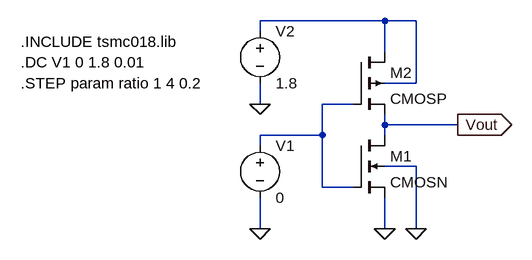
[diagram p0: schematic Assignment 5.asc]
Assignment 5.asc, the LTspice schematic file:
Version 4
SHEET 1 880 680
WIRE 496 160 304 160
WIRE 544 160 496 160
WIRE 304 176 304 160
WIRE 496 208 496 160
WIRE 544 256 544 160
WIRE 544 256 496 256
WIRE 304 288 304 256
WIRE 448 288 400 288
WIRE 496 320 496 304
WIRE 608 320 496 320
WIRE 400 336 400 288
WIRE 400 336 304 336
WIRE 496 336 496 320
WIRE 304 352 304 336
WIRE 544 384 496 384
WIRE 400 416 400 336
WIRE 448 416 400 416
WIRE 304 480 304 432
WIRE 496 480 496 432
WIRE 544 480 544 384
FLAG 496 480 0
FLAG 544 480 0
FLAG 304 480 0
FLAG 304 288 0
FLAG 608 320 Vout
IOPIN 608 320 Out
SYMBOL cmosn 448 336 R0
SYMATTR InstName M1
SYMATTR Value2 l=180n w=1u
SYMBOL cmosp 448 208 R0
SYMATTR InstName M2
SYMATTR Value2 l=180n w={ratio*1u}
SYMBOL Voltage 304 336 R0
SYMATTR InstName V1
SYMATTR Value 0
SYMBOL Voltage 304 160 R0
SYMATTR InstName V2
SYMATTR Value 1.8
TEXT -64 192 Left 2 !.INCLUDE tsmc018.lib
TEXT -64 224 Left 2 !.DC V1 0 1.8 0.01
TEXT -64 256 Left 2 !.STEP param ratio 1 4 0.2

The netlist it stands for:
* Assignment 5.asc
M1 Vout N002 0 0 CMOSN l=180n w=1u
M2 N001 N002 Vout N001 CMOSP l=180n w={ratio*1u}
V1 N002 0 0
V2 N001 0 1.8
.model NMOS NMOS
.model PMOS PMOS
.lib standard.mos
.INCLUDE tsmc018.lib
.DC V1 0 1.8 0.01
.STEP param ratio 1 4 0.2
.backanno
.end